# Altium schematic sheet LED.SchDoc: LED
size B; Author: Sébastien Gélinas; Organization: SmartHalo; Address1: 5445 de Gaspé; Address2: Montréal, QC; Address3: Canada; Address4: H2T 3B2; DocumentNumber: 3; Revision: 1; SheetNumber: 3; SheetTotal: 4
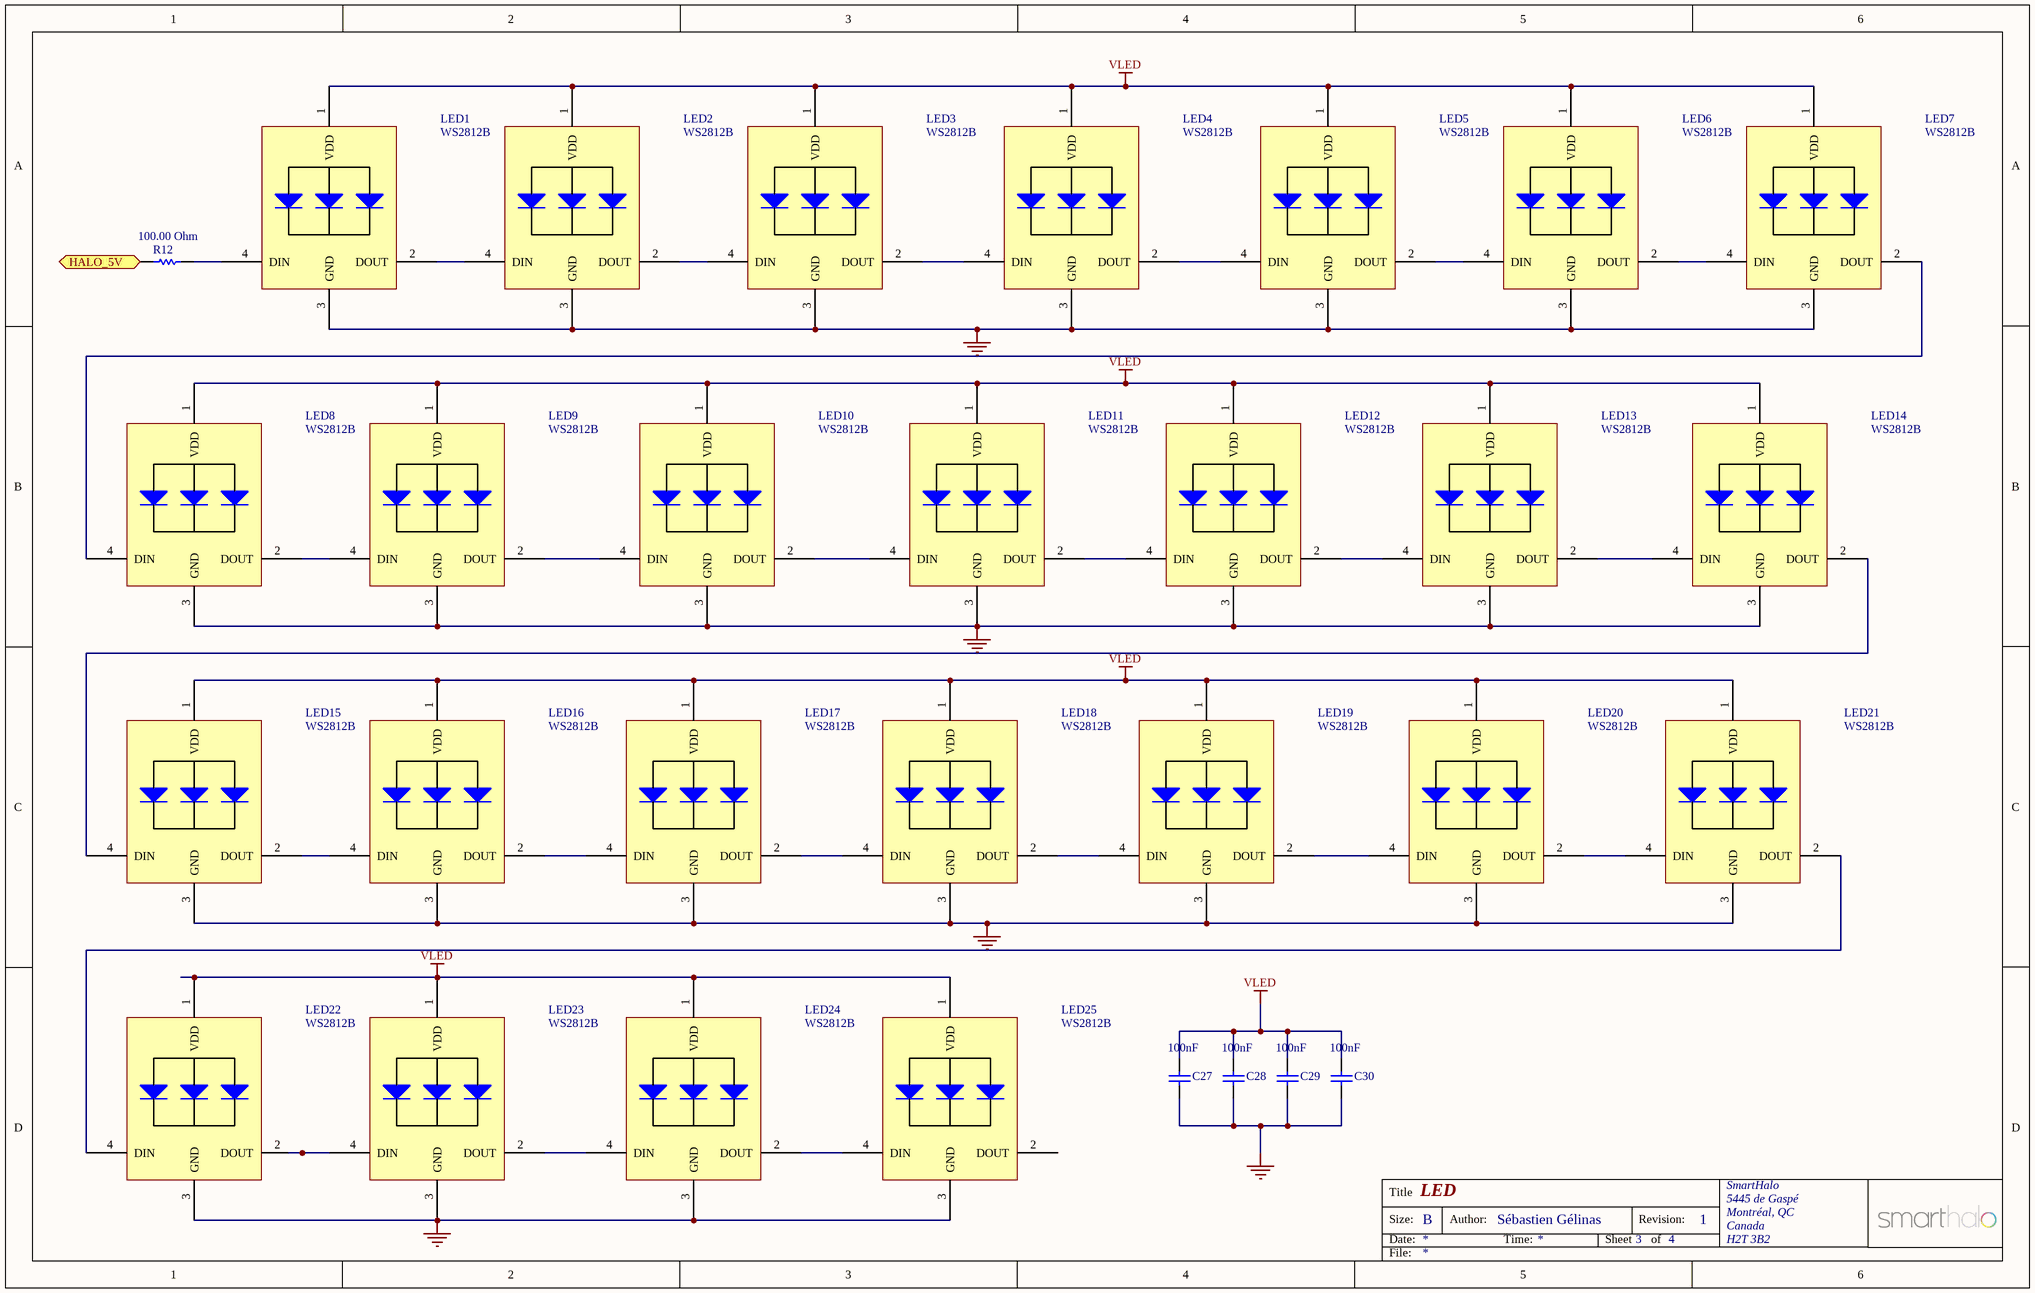
[diagram p0: LED.SchDoc]

## Parts
C27  Capacitance: 100nF  [CAPC0402(1005)60_L]  (hidden comment: CAP 100nF 10V 0402(1005))
C28  Capacitance: 100nF  [CAPC0402(1005)60_L]  (hidden comment: CAP 100nF 10V 0402(1005))
C29  Capacitance: 100nF  [CAPC0402(1005)60_L]  (hidden comment: CAP 100nF 10V 0402(1005))
C30  Capacitance: 100nF  [CAPC0402(1005)60_L]  (hidden comment: CAP 100nF 10V 0402(1005))
LED1  WS2812B  [WS2812B5050]
LED2  WS2812B  [WS2812B5050]
LED3  WS2812B  [WS2812B5050]
LED4  WS2812B  [WS2812B5050]
LED5  WS2812B  [WS2812B5050]
LED6  WS2812B  [WS2812B5050]
LED7  WS2812B  [WS2812B5050]
LED8  WS2812B  [WS2812B5050]
LED9  WS2812B  [WS2812B5050]
LED10  WS2812B  [WS2812B5050]
LED11  WS2812B  [WS2812B5050]
LED12  WS2812B  [WS2812B5050]
LED13  WS2812B  [WS2812B5050]
LED14  WS2812B  [WS2812B5050]
LED15  WS2812B  [WS2812B5050]
LED16  WS2812B  [WS2812B5050]
LED17  WS2812B  [WS2812B5050]
LED18  WS2812B  [WS2812B5050]
LED19  WS2812B  [WS2812B5050]
LED20  WS2812B  [WS2812B5050]
LED21  WS2812B  [WS2812B5050]
LED22  WS2812B  [WS2812B5050]
LED23  WS2812B  [WS2812B5050]
LED24  WS2812B  [WS2812B5050]
LED25  WS2812B  [WS2812B5050]
R12  Resistance: 100.00 Ohm  [RESC0402(1005)_L]  (hidden comment: 100R ±5% 0402(1005))

## Ports
HALO_5V (in)

## Nets
GND: C27.1 C28.1 C29.1 C30.1 LED1.3(GND) LED2.3(GND) LED3.3(GND) LED4.3(GND) LED5.3(GND) LED6.3(GND) LED7.3(GND) LED8.3(GND) LED9.3(GND) LED10.3(GND) LED11.3(GND) LED12.3(GND) LED13.3(GND) LED14.3(GND) LED15.3(GND) LED16.3(GND) LED17.3(GND) LED18.3(GND) LED19.3(GND) LED20.3(GND) LED21.3(GND) LED22.3(GND) LED23.3(GND) LED24.3(GND) LED25.3(GND)
VLED: C27.2 C28.2 C29.2 C30.2 LED1.1(VDD) LED2.1(VDD) LED3.1(VDD) LED4.1(VDD) LED5.1(VDD) LED6.1(VDD) LED7.1(VDD) LED8.1(VDD) LED9.1(VDD) LED10.1(VDD) LED11.1(VDD) LED12.1(VDD) LED13.1(VDD) LED14.1(VDD) LED15.1(VDD) LED16.1(VDD) LED17.1(VDD) LED18.1(VDD) LED19.1(VDD) LED20.1(VDD) LED21.1(VDD) LED22.1(VDD) LED23.1(VDD) LED24.1(VDD) LED25.1(VDD)
HALO_5V: R12.1 ; port HALO_5V
NetLED1_2: LED1.2(DOUT) LED2.4(DIN)
NetLED1_4: LED1.4(DIN) R12.2
NetLED2_2: LED2.2(DOUT) LED3.4(DIN)
NetLED3_2: LED3.2(DOUT) LED4.4(DIN)
NetLED4_2: LED4.2(DOUT) LED5.4(DIN)
NetLED5_2: LED5.2(DOUT) LED6.4(DIN)
NetLED6_2: LED6.2(DOUT) LED7.4(DIN)
NetLED7_2: LED7.2(DOUT) LED8.4(DIN)
NetLED8_2: LED8.2(DOUT) LED9.4(DIN)
NetLED9_2: LED9.2(DOUT) LED10.4(DIN)
NetLED10_2: LED10.2(DOUT) LED11.4(DIN)
NetLED11_2: LED11.2(DOUT) LED12.4(DIN)
NetLED12_2: LED12.2(DOUT) LED13.4(DIN)
NetLED13_2: LED13.2(DOUT) LED14.4(DIN)
NetLED14_2: LED14.2(DOUT) LED15.4(DIN)
NetLED15_2: LED15.2(DOUT) LED16.4(DIN)
NetLED16_2: LED16.2(DOUT) LED17.4(DIN)
NetLED17_2: LED17.2(DOUT) LED18.4(DIN)
NetLED18_2: LED18.2(DOUT) LED19.4(DIN)
NetLED19_2: LED19.2(DOUT) LED20.4(DIN)
NetLED20_2: LED20.2(DOUT) LED21.4(DIN)
NetLED21_2: LED21.2(DOUT) LED22.4(DIN)
NetLED22_2: LED22.2(DOUT) LED23.4(DIN)
NetLED23_2: LED23.2(DOUT) LED24.4(DIN)
NetLED24_2: LED24.2(DOUT) LED25.4(DIN)

Not connected (* = marked no-connect by the designer): LED25 2(DOUT)

## Notes on the sheet
- Title
- Size:
- Date:
- B
- Author:
- Time:
- Sheet
- Revision:
- of
- File:

## Library data of the parts
C27-C30 = CMP-1034-02064-1: CAP 100nF 10V ±5% 0402 (1005 Metric); Case-EIA: 0402; Case-Metric: 1005; Tolerance: ±5%; Rated Voltage: 10 V
LED1-LED25 = WS2812B5050: IC RGB LED 5V SERIAL
R12 = CMP-1011-00050-1: 100R 0.063W ±5% 0402 (1005 Metric); Case-EIA: 0402; Case-Metric: 1005; Power: 0.063 W; Tolerance: ±5 %